# Altium project linefollower.PrjPcb
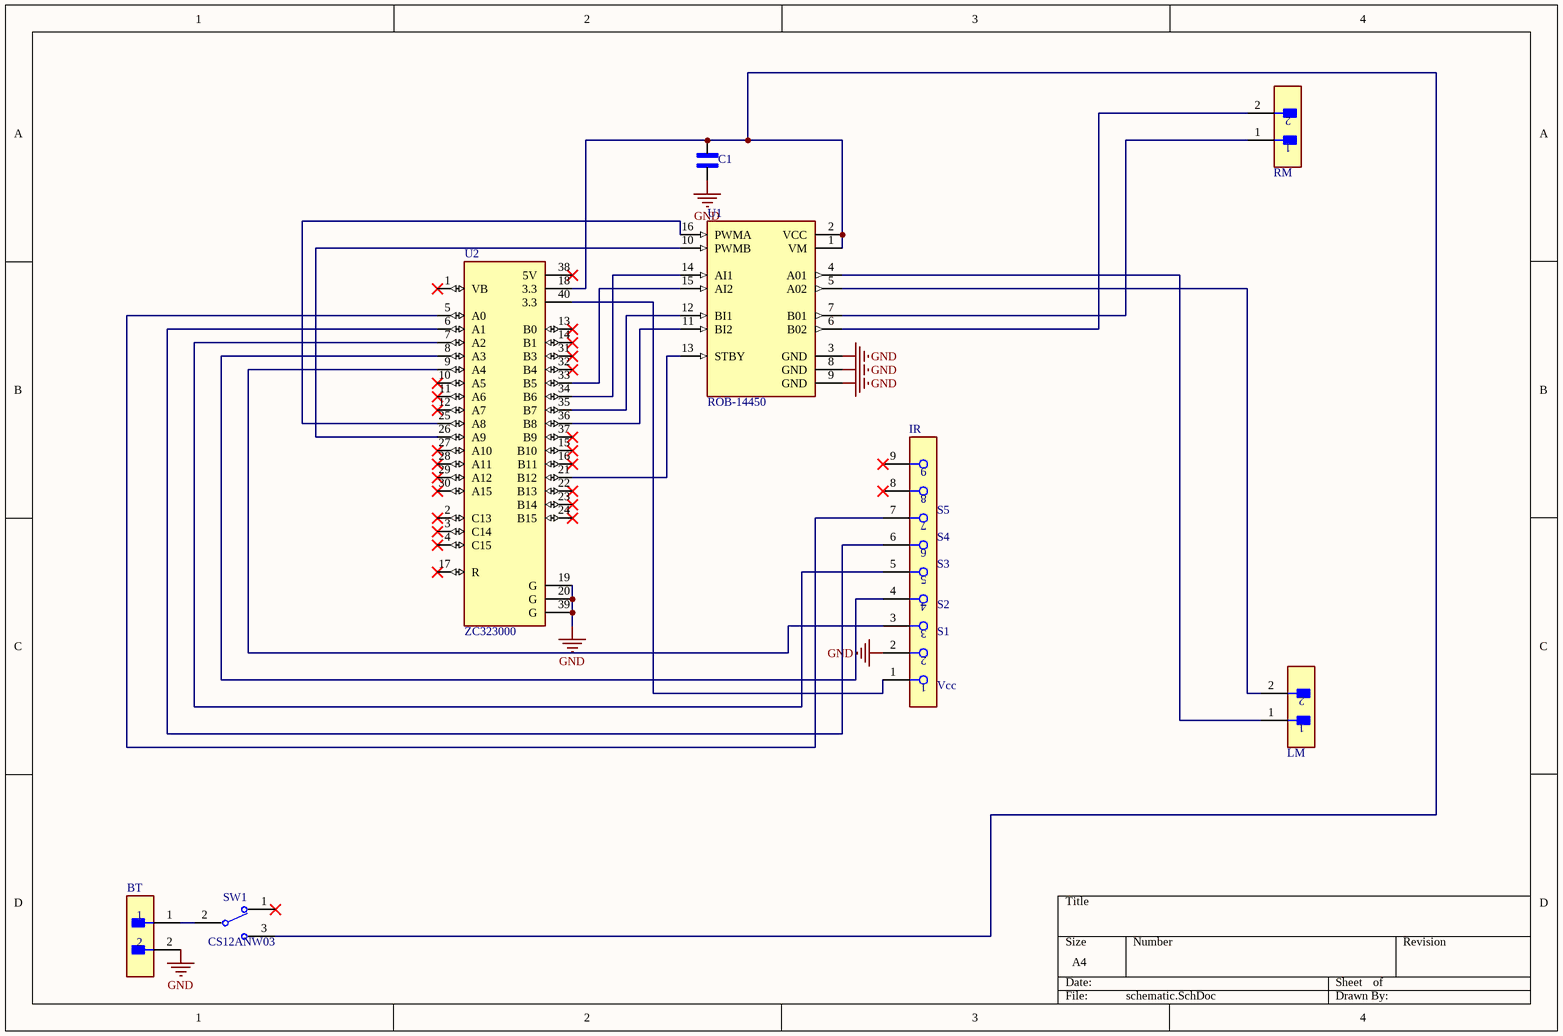
[diagram p0: schematic.SchDoc]
1 sheet, 8 parts. Net scope: global (net labels, ports and power ports of the same name join across sheets).
Board files: PCB.PcbDoc, LEVEL1.PcbDoc

## Sheet schematic.SchDoc
size A4; SheetNumber: 1; SheetTotal: 1

### Parts
BT  B2B-XH-AM(LF)(SN)  [FP-B2B-XH-AM_LF_SN-MFG]  (value not drawn)
C1  FA14X8R1H104KNU06  [CAPRB250W50L450T300H550]  (value not drawn)
IR  CES-109-01-G-S  [FP-CES-109-01-G-S-MFG]  (value not drawn)
LM  TSW-102-12-T-S  [FP-TSW-102-12-T-S-MFG]  (value not drawn)
RM  TSW-102-12-T-S  [FP-TSW-102-12-T-S-MFG]  (value not drawn)
SW1  CS12ANW03  [FP-CS12ANW03-MFG]
U1  ROB-14450  [MODULE_ROB-14450]
U2  ZC323000  [MODULE_ZC323000]

### Nets
GND: BT.2 C1.1 IR.2 U1.3(GND) U1.8(GND) U1.9(GND) U2.19(G) U2.20(G) U2.39(G)
NetBT_1: BT.1 SW1.2(2(COM))
NetC1_2: C1.2 SW1.3 U1.1(VM) U1.2(VCC) U2.18(3.3)
NetIR_1: IR.1 U2.40(3.3)
NetIR_3: IR.3 U2.9(A4)
NetIR_4: IR.4 U2.8(A3)
NetIR_5: IR.5 U2.7(A2)
NetIR_6: IR.6 U2.6(A1)
NetIR_7: IR.7 U2.5(A0)
NetLM_1: LM.1 U1.4(A01)
NetLM_2: LM.2 U1.5(A02)
NetRM_1: RM.1 U1.7(B01)
NetRM_2: RM.2 U1.6(B02)
NetU1_10: U1.10(PWMB) U2.26(A9)
NetU1_11: U1.11(BI2) U2.36(B8)
NetU1_12: U1.12(BI1) U2.35(B7)
NetU1_13: U1.13(STBY) U2.21(B12)
NetU1_14: U1.14(AI1) U2.34(B6)
NetU1_15: U1.15(AI2) U2.33(B5)
NetU1_16: U1.16(PWMA) U2.25(A8)

Not connected (* = marked no-connect by the designer): IR 8* 9*; SW1 1*; U2 1(VB)* 2(C13)* 3(C14)* 4(C15)* 10(A5)* 11(A6)* 12(A7)* 13(B0)* 14(B1)* 15(B10)* 16(B11)* 17(R)* 22(B13)* 23(B14)* 24(B15)* 27(A10)* 28(A11)* 29(A12)* 30(A15)* 31(B3)* 32(B4)* 37(B9)* 38(5V)*

### Notes on the sheet
- (near IR) S5
- (near IR) S3
- (near IR) S4
- (near IR) S1
- (near IR) S2
- (near IR) Vcc

### Library data of the parts
BT = CMP-17439-000037-1: CONN HEADER VERT 2POS 2.5MM; Max Voltage Rating (AC): 250V; Connector Type: Male Pin; Contact Resistance: 20mR; Max Current Rating: 3A; Number of Positions: 2; Series: XH; Contact Material: Brass; Mount: Through Hole; Housing Material: Polyamide; Contact Plating: Tin; Termination: Solder; Max Operating Temperature: 85°C; Depth: 5.75mm; Packaging: Bulk; Min Operating Temperature: -25°C; Contact Type: Male Pin; Color: Green; Pitch: 2.5mm; Length: 7.4mm; Lead Free: Lead Free; Number of Rows: 1; Fastening Type: Detent; Housing Color: White; Orientation: Straight
C1 = FA14X8R1H104KNU06: 0.1 ÂµF Â±10% 50V Ceramic Capacitor X8R Radial; MF: TDK; SnapEDA_Link: https://www.snapeda.com/parts/FA14X8R1H104KNU06/TDK/view-part/?ref=snap; Package: NON STANDARD-2 TDK; Value: *; MP: FA14X8R1H104KNU06; Check_prices: https://www.snapeda.com/parts/FA14X8R1H104KNU06/TDK/view-part/?ref=eda
IR = CMP-00575-09340057-1: CES-109-01-G-S Conn Socket Strip SKT 9 POS 2.54mm Solder ST Top Entry Thru-Hole Tube; Manufacturer Lifecycle Status: PRODUCTION; Current Rating: 5.5A; Max Current Rating: 1A; Number of Contacts: 9; Max Voltage Rating (AC): 333V; Voltage Rating: 400V; Gender: Receptacle; Contact Resistance: 10mΩ; Depth: 3.05mm; NexarPartId: 9340057; Contact Plating: Gold; Termination: Solder; Housing Color: Black; REACH SVHC: No SVHC; Contact Material: Bronze, Gold, Nickel; Min Operating Temperature: -55°C; Radiation Hardening: No; Orientation: Straight; Length: 22.86mm; RoHS: Compliant; Housing Material: Polyester; Lifecycle Status: Production; Max Operating Temperature: 125°C; Pitch: 2.54mm; Height: 5.21mm; Number of Rows: 1
LM RM = CMP-02766-001444-1: CONN HEADER VERT 2POS 2.54MM; Gender: Male; Number of Contacts: 2; RoHS Compliant: Yes; Mount: Through Hole; Termination: Solder; Packaging: Bulk; Contact Material: Bronze; Contact Plating: Tin; Number of Rows: 1; REACH SVHC: No SVHC; Pitch: 2.54mm; Radiation Hardening: No
SW1 = CMP-31746-000002-1: SWITCH SLIDE SPDT 3A 125V; Max Voltage Rating (AC): 250V; Mechanical Life: 50000Cycles; Switch Travel: 2.2mm; Electrical Life: 20000Cycles; Actuator Length: 5.1mm; Illumination Type: Non-Illuminated; Contact Style: Non-Shorting; Actuator Type: Standard; Actuator Material: Nylon; Switch Function: On-On; Max Operating Temperature: 85°C; Series: CS; Contact Current Rating: 3A; Min Operating Temperature: -30°C; Current Rating: 3A; Mount: Through Hole; Depth: 7.5mm; RoHS Compliant: Yes; Throw Configuration: SPDT; Lead Free: Lead Free; Orientation: Vertical; Contact Plating: Silver; Reach SVHC Compliant: Yes; Termination: PC Pin; Max Current Rating: 3A; Packaging: Tray; Length: 14mm; Package Quantity: 1; Primary Type: SWITCH; Flammability Rating: UL94 V-0; Contact Material: Copper; Voltage Rating (AC): 125V
U1 = ROB-14450: TB6612FNG Motor Controller/Driver Power Management Evaluation Board; MF: SparkFun Electronics; Check_prices: https://www.snapeda.com/parts/ROB-14450/SparkFun%20Electronics/view-part/2656367/?ref=eda; Package: None; MP: ROB-14450; Value: *; Availability: In Stock; SnapEDA_Link: https://www.snapeda.com/parts/ROB-14450/SparkFun%20Electronics/view-part/2656367/?ref=snap; Price: None
U2 = ZC323000: STM32F103C8T6 ARM STM32 Minimum System Development Board Module For Arduino; Package: None; MP: ZC323000; Value: *; Availability: Unavailable; Price: None